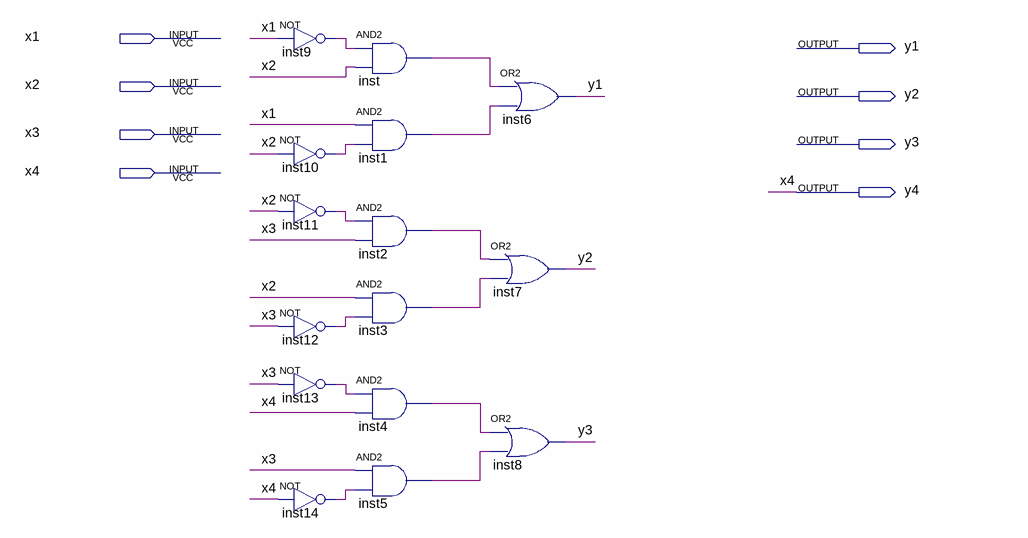
[diagram p0: schematic sheet]
// Quartus schematic Lab3.bdf as structural Verilog: 15 symbols, 8 pins
module Lab3 (
  input  x1,
  input  x2,
  input  x3,
  input  x4,
  output y1,
  output y2,
  output y3,
  output y4
);

  wire inst1_out, inst2_out, inst3_out, inst4_out, inst5_out, inst9_out, inst10_out, inst11_out, inst12_out,
       inst13_out, inst14_out, inst_out;

  not inst9 (inst9_out, x1);
  not inst10 (inst10_out, x2);
  not inst11 (inst11_out, x2);
  not inst12 (inst12_out, x3);
  not inst13 (inst13_out, x3);
  not inst14 (inst14_out, x4);
  and inst (inst_out, inst9_out, x2);
  and inst1 (inst1_out, x1, inst10_out);
  and inst2 (inst2_out, inst11_out, x3);
  and inst3 (inst3_out, x2, inst12_out);
  and inst4 (inst4_out, inst13_out, x4);
  and inst5 (inst5_out, x3, inst14_out);
  or inst7 (y2, inst2_out, inst3_out);
  or inst8 (y3, inst4_out, inst5_out);
  or inst6 (y1, inst_out, inst1_out);

  assign y4 = x4;
endmodule
